# Altium schematic sheet MCU.SchDoc: MCU board
size A4; Date: 30.05.2015; Author: Grzegorz Gajoch; Engineer: Grzegorz Gajoch; DocumentNumber: 4; SheetNumber: 4; SheetTotal: 9; Model: EM1; PageSetup: Record=PageOptions|CenterHorizontal=True|CenterVertical=True|PrintScale=0.52|XCorrection=1.00|YCorrection=1.00|PrintKind=1|BorderSize=5000000|LeftOffset=0|BottomOffset=0|Orientation=2|PaperLength=4200|PaperWidth=2970|Scale=100|PaperSource=7|PrintQuality=600|MediaType=1|DitherType=10|PaperKind=A3|PrintScaleMode=1
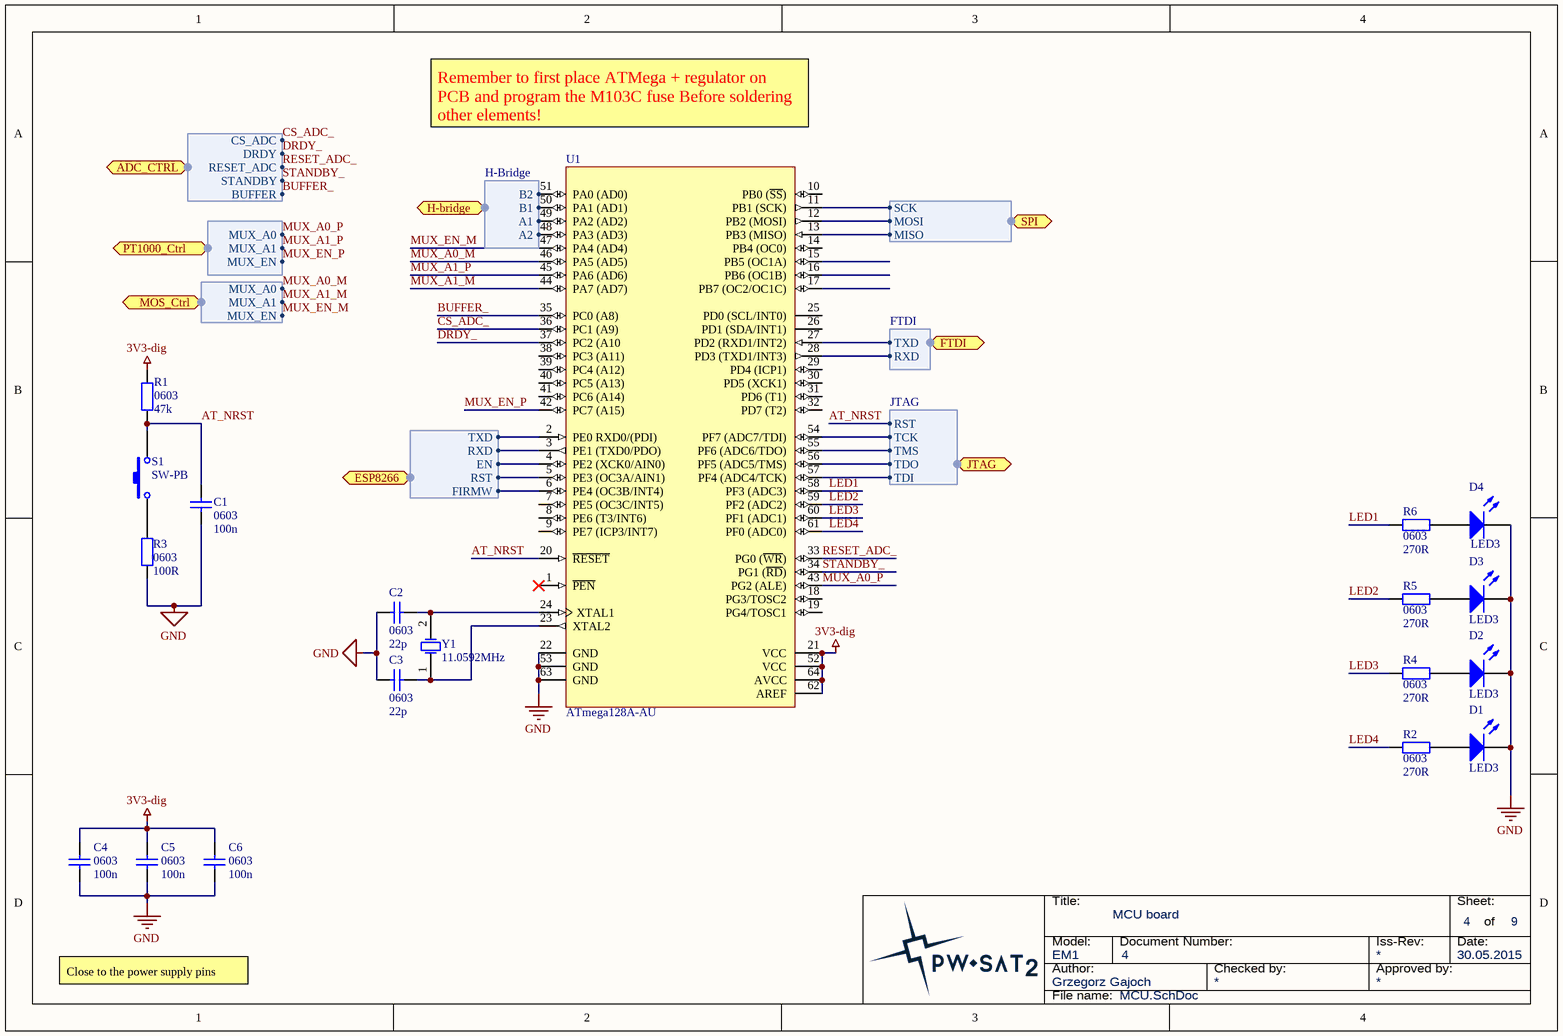
[diagram p0: MCU.SchDoc]

## Parts
C1  0603  value 100n  [SMD_Capacitor_0603]
C2  0603  value 22p  [SMD_Capacitor_0603]
C3  0603  value 22p  [SMD_Capacitor_0603]
C4  0603  value 100n  [SMD_Capacitor_0603]
C5  0603  value 100n  [SMD_Capacitor_0603]
C6  0603  value 100n  [SMD_Capacitor_0603]
D1  LED3  [LED 0805 RED]
D2  LED3  [LED 0805 GREEN]
D3  LED3  [LED 0805 Yellow]
D4  LED3  [LED 0805 Blue]
R1  0603  value 47k  [SMD_Resistor_0603]
R2  0603  value 270R  [SMD_Resistor_0603]
R3  0603  value 100R  [SMD_Resistor_0603]
R4  0603  value 270R  [SMD_Resistor_0603]
R5  0603  value 270R  [SMD_Resistor_0603]
R6  0603  value 270R  [SMD_Resistor_0603]
S1  SW-PB  [Tact Switch 3x6]
U1  ATmega128A-AU  [64A_M]
Y1  11.0592MHz  [Quartz]

## Ports
ADC_CTRL (harness ADC_CTRL), ESP8266 (harness ESP8266), FTDI (harness FTDI), H-bridge (harness H-Bridge), JTAG (harness JTAG), MOS_Ctrl (harness MUX_Ctrl), PT1000_Ctrl (harness MUX_Ctrl), SPI (harness SPI)

## Harnesses
JTAG: TCK, TMS, TDO, TDI, RST
MUX_Ctrl: MUX_A0, MUX_A1, MUX_EN
SPI: SCK, MOSI, MISO
FTDI: RXD, TXD
ADC_CTRL: CS_ADC, DRDY, RESET_ADC, STANDBY, BUFFER
ESP8266: TXD, RXD, EN, RST, FIRMW
H-Bridge: A1, A2, B1, B2

## Nets
3V3-dig: C4.2 C5.2 C6.2 R1.2 U1.21(VCC) U1.52(VCC) U1.62(AREF) U1.64(AVCC)
GND: C1.1 C2.1 C3.1 C4.1 C5.1 C6.1 D1.2(K) D2.2(K) D3.2(K) D4.2(K) R3.2 U1.22(GND) U1.53(GND) U1.63(GND)
AT_NRST: C1.2 R1.1 S1.2 U1.20(~{RESET}) ; port JTAG.RST
BUFFER_: U1.35(PC0_(A8)) ; port ADC_CTRL.BUFFER
CS_ADC_: U1.36(PC1_(A9)) ; port ADC_CTRL.CS_ADC
DRDY_: U1.37(PC2_(A10) ; port ADC_CTRL.DRDY
LED1: R6.2 U1.58(PF3_(ADC3))
LED2: R5.2 U1.59(PF2_(ADC2))
LED3: R4.2 U1.60(PF1_(ADC1))
LED4: R2.2 U1.61(PF0_(ADC0))
MUX_A0_M: U1.46(PA5_(AD5)) ; port MOS_Ctrl.MUX_A0
MUX_A0_P: U1.43(PG2_(ALE)) ; port PT1000_Ctrl.MUX_A0
MUX_A1_M: U1.44(PA7_(AD7)) ; port MOS_Ctrl.MUX_A1
MUX_A1_P: U1.45(PA6_(AD6)) ; port PT1000_Ctrl.MUX_A1
MUX_EN_M: U1.47(PA4_(AD4)) ; port MOS_Ctrl.MUX_EN
MUX_EN_P: U1.42(PC7_(A15)) ; port PT1000_Ctrl.MUX_EN
RESET_ADC_: U1.33(PG0_(~{WR})) ; port ADC_CTRL.RESET_ADC
STANDBY_: U1.34(PG1_(~{RD})) ; port ADC_CTRL.STANDBY
NetC2_2: C2.2 U1.24(XTAL1) Y1.2(OSC2)
NetC3_2: C3.2 U1.23(XTAL2) Y1.1(OSC1)
NetD1_1: D1.1(A) R2.1
NetD2_1: D2.1(A) R4.1
NetD3_1: D3.1(A) R5.1
NetD4_1: D4.1(A) R6.1
NetR3_1: R3.1 S1.1
NetU1_2: U1.2(PE0_RXD0/(PDI)) ; port ESP8266.TXD
NetU1_3: U1.3(PE1_(TXD0/PDO)) ; port ESP8266.RXD
NetU1_4: U1.4(PE2_(XCK0/AIN0)) ; port ESP8266.EN
NetU1_5: U1.5(PE3_(OC3A/AIN1)) ; port ESP8266.RST
NetU1_6: U1.6(PE4_(OC3B/INT4)) ; port ESP8266.FIRMW
NetU1_11: U1.11(PB1_(SCK)) ; port SPI.SCK
NetU1_12: U1.12(PB2_(MOSI)) ; port SPI.MOSI
NetU1_13: U1.13(PB3_(MISO)) ; port SPI.MISO
NetU1_27: U1.27(PD2_(RXD1/INT2)) ; port FTDI.TXD
NetU1_28: U1.28(PD3_(TXD1/INT3)) ; port FTDI.RXD
NetU1_48: U1.48(PA3_(AD3)) ; port H-bridge.A2
NetU1_49: U1.49(PA2_(AD2)) ; port H-bridge.A1
NetU1_50: U1.50(PA1_(AD1)) ; port H-bridge.B1
NetU1_51: U1.51(PA0_(AD0)) ; port H-bridge.B2
NetU1_54: U1.54(PF7_(ADC7/TDI)) ; port JTAG.TCK
NetU1_55: U1.55(PF6_(ADC6/TDO)) ; port JTAG.TMS
NetU1_56: U1.56(PF5_(ADC5/TMS)) ; port JTAG.TDO
NetU1_57: U1.57(PF4_(ADC4/TCK)) ; port JTAG.TDI

Not connected (* = marked no-connect by the designer): U1 1(~{PEN})* 7(PE5_(OC3C/INT5)) 8(PE6_(T3/INT6)) 9(PE7_(ICP3/INT7)) 10(PB0_(~{SS})) 14(PB4_(OC0)) 15(PB5_(OC1A)) 16(PB6_(OC1B)) 17(PB7_(OC2/OC1C)) 18(PG3/TOSC2) 19(PG4/TOSC1) 25(PD0_(SCL/INT0)) 26(PD1_(SDA/INT1)) 29(PD4_(ICP1)) 30(PD5_(XCK1)) 31(PD6_(T1)) 32(PD7_(T2)) 38(PC3_(A11)) 39(PC4_(A12)) 40(PC5_(A13)) 41(PC6_(A14))

## Notes on the sheet
- Remember to first place ATMega + regulator on PCB and program the M103C fuse Before soldering other elements!
- Close to the power supply pins
- Title:
- Sheet:
- of
- Author:
- Model:
- Document Number:
- Checked by:
- Iss-Rev:
- Approved by:
- Date:
- File name:

## Library data of the parts
C1 C4-C6 = Cap: Capacitor; Published: 8-Jun-2000; LatestRevisionDate: 17-Jul-2002; LatestRevisionNote: Re-released for DXP Platform.; PackageReference: RAD-0.3; Publisher: Altium Limited; PackageDescription: Radial Cap, Thru-Hole; 2 Leads; 0.3 in Pin Spacing
C2 C3 = Cap1: Capacitor; Published: 8-Jun-2000; LatestRevisionDate: 17-Jul-2002; LatestRevisionNote: Re-released for DXP Platform.; PackageReference: RAD-0.3; Publisher: Altium Limited; PackageDescription: Radial Cap, Thru-Hole; 2 Leads; 0.3 in Pin Spacing
D1-D4 = LED3: Typical BLUE SiC LED; Published: 8-Jun-2000; LatestRevisionDate: 17-Dec-2003; LatestRevisionNote: PCB Footprint replaced.; DatasheetVersion: 16-Apr-2002; PackageVersion: 16-Apr-2002; PackageReference: 3.5X2.8X1.9; Publisher: Altium Limited; PackageDescription: SM LED; 2 C-Bend Leads; Body 3.5 x 2.8 x 1.9 mm, inc leads (LxWxH typ)
R1-R6 = Res2: Resistor; Published: 8-Jun-2000; LatestRevisionDate: 17-Jul-2002; LatestRevisionNote: Re-released for DXP Platform.; PackageReference: AXIAL-0.4; Publisher: Altium Limited; PackageDescription: Axial Device, Thru-Hole; 2 Leads; 0.4 in Pin Spacing
S1 = SW-PB: Switch; Published: 24-Mar-1999; LatestRevisionDate: 17-Jul-2002; LatestRevisionNote: Re-released for DXP Platform.; PackageReference: SPST-2; Publisher: Altium Limited; PackageDescription: Switch; 2 Leads
U1 = ATmega128A-AU: 8-bit AVR Microcontroller, 2.7-5.5V, 16MHz, 128KB Flash, 4KB EEPROM, 4KB SRAM, 64-pin TQFP, Industrial Grade (-40°C to 85°C); DatasheetVersion: revH, Feb-2011; PackageVersion: revC, Oct-2010; PackageReference: 64A; PackageDescription: 64-Pin Plastic Thin Profile Quad Flat Pack, 14 x 14 x 1.0 mm Body, 0.8 mm Pitch (TQFP); Code_JEDEC: MS-026-AEB; ComponentLink1Description: Manufacturer URL; ComponentLink1URL: http://www.atmel.com/; ComponentLink2Description: ATmega128A Datasheet; ComponentLink2URL: http://www.atmel.com/dyn/resources/prod_documents/doc8151.pdf; ComponentLink3Description: ATmega128A Summary; ComponentLink3URL: http://www.atmel.com/dyn/resources/prod_documents/8151S.pdf
Y1 = XTAL: LF XTAL003519; Published: 8-Jun-2000; LatestRevisionDate: 17-Jul-2002; LatestRevisionNote: Re-released for DXP Platform.; PackageReference: R38; Publisher: Altium Limited; PackageDescription: Crystal, Thru-Hole; 2 Leads; Body 3.1 x 8.2 mm (Dia.xH)